# Altium schematic sheet PSU_LM1084_ADJ.SchDoc: PSU LM1084 ADJ
size A4; Organization: Altium Limited.; Address1: Level 3, 12a Rodborough Rd; Address2: Frenchs Forest 2086; Address3: NSW; Address4: AUSTRALIA; SheetNumber: 1; SheetTotal: 100
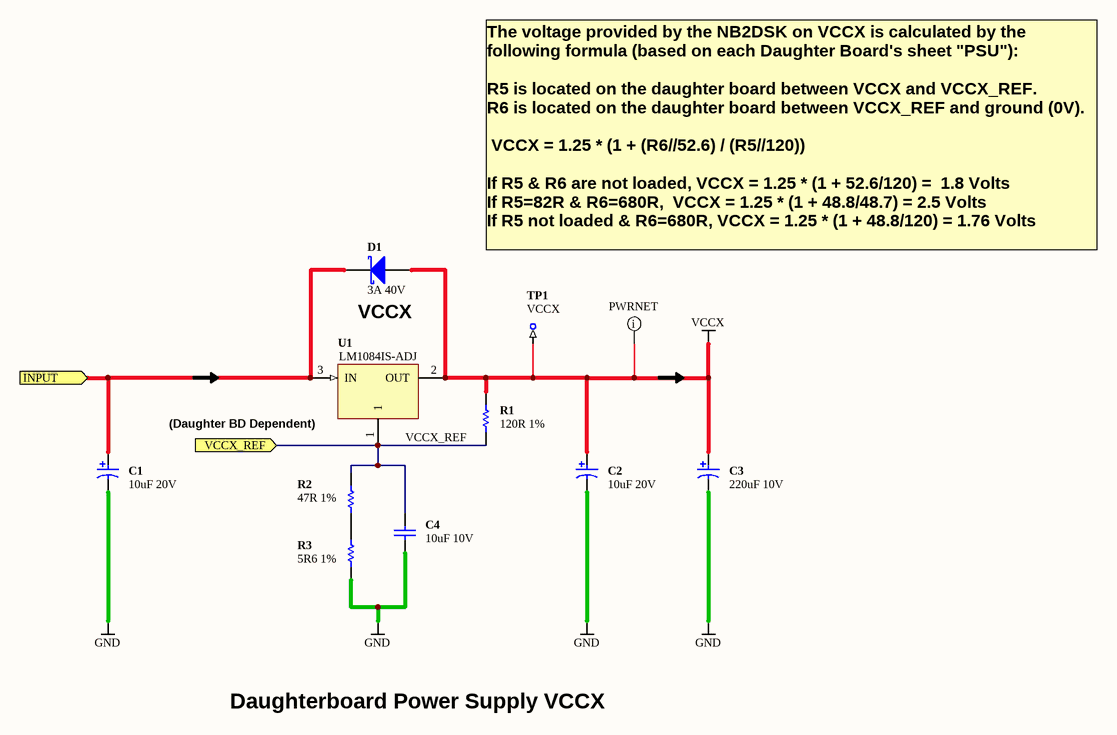
[diagram p0: PSU_LM1084_ADJ.SchDoc]

## Parts
C1  10uF 20V  [CAPC3528-STAR]
C2  10uF 20V  [CAPC3528-STAR]
C3  220uF 10V  [CAPC7343-STAR]
C4  10uF 10V  [CAPC2012-STAR]
D1  3A 40V  [DIOM5027]
R1  120R 1%  [RESC1005-STAR]
R2  47R 1%  [RESC1005-STAR]
R3  5R6 1%  [RESC1005-STAR]
TP1  VCCX  [TestPin]  (no BOM)
U1  LM1084IS-ADJ  [TO254P1435-4]

## Ports
INPUT (in), VCCX_REF (in)

## Nets
GND: C1.2 C2.2 C3.2 C4.1 R3.2
VCCX: C2.1 C3.1 D1.1(A) R1.1 TP1.1 U1.2(OUT) U1.4(HeatSink)
INPUT: C1.1 D1.2(K) U1.3(IN) ; port INPUT
VCCX_REF: C4.2 R1.2 R2.1 U1.1 ; port VCCX_REF
NetR2_2: R2.2 R3.1

## Layout directives
net class PWRNET: VCCX

## Notes on the sheet
- The voltage provided by the NB2DSK on VCCX is calculated by the following formula (based on each Daughter Board's sheet "PSU"):
  R5 is located on the daughter board between VCCX and VCCX_REF.
  R6 is located on the daughter board between VCCX_REF and ground (0V).
  VCCX = 1.25 * (1 + (R6//52.6) / (R5//120))
  If R5 & R6 are not loaded,	VCCX = 1.25 * (1 + 52.6/120) =  1.8 Volts
  If R5=82R & R6=680R, 	VCCX = 1.25 * (1 + 48.8/48.7) = 2.5 Volts
  If R5 not loaded & R6=680R,	VCCX = 1.25 * (1 + 48.8/120) = 1.76 Volts
- (near D1) VCCX
- (near U1) (Daughter BD Dependent)
- Daughterboard Power Supply VCCX
- Sheet Title
- Project Title
- Size:
- Date:
- A4
- Assy:
- Time:
- Revision:
- Sheet
- of
- File:

## Library data of the parts
C1 C2 = D-101-0007: Capacitor, Tantalum, 10uF 10% 20V MCCT-B (3528); Polarity: Polarized; Category: Capacitor; Capacitance: 10 uF; Mounting Technology: Surface Mount; Rated Voltage: 20 V; Status: Production; Technology: Tantalum; Tolerance: 10 %
C3 = D-101-0088: Capacitor, Tantalum, 220uF 10% 10V MCCT-D (7343-31); Polarity: Polarized; Category: Capacitor; Capacitance: 220 uF; Mounting Technology: Surface Mount; Rated Voltage: 10 V; Status: Unreleased; Technology: Tantalum; Tolerance: 10 %
C4 = D-101-0087: Capacitor, Ceramic, 10uF 10% 10V 0805 (2012) X5R; Polarity: Non-Polarized; Category: Capacitor; Capacitance: 10 uF; Dielectric: X5R; Mounting Technology: Surface Mount; Rated Voltage: 10 V; Status: Unreleased; Technology: None; Tolerance: 10 %
D1 = D-151-0000: Schottky Diode, 3A 40V; Category: Diode-Schottky; Status: Production
R1 = D-100-0126: Resistor, 120R 1% 0402 (1005); Power Rating: 63 mW; Category: Resistor; Mounting Technology: Surface Mount; Resistance: 120 R; Status: Production; Tolerance: 1 %
R2 = D-100-0090: Resistor, 47R 1% 0402 (1005); Power Rating: 63 mW; Category: Resistor; Mounting Technology: Surface Mount; Resistance: 47 R; Status: Production; Tolerance: 1 %
R3 = D-100-0085: Resistor, 5R6 1% 0402 (1005); Power Rating: 63 mW; Resistance: 5.6 R; Category: Resistor; Mounting Technology: Surface Mount; Status: Production; Tolerance: 1 %
TP1 = D-006-0000: Test Point, PCB Mount with Silkscreen Box; Category: Test-Point; Status: Production
U1 = D-204-0004: LM1084IS-ADJ, 5A Low Dropout Positive Regulators; Max Input Voltage: mV; Max Output Current: mA; Category: IC-Power; Max Output Voltage: mV; Min Input Voltage: mV; Min Output Voltage: mV; Mounting Technology: Surface Mount; Status: Production; Supply Voltage: mV